# EAGLE board main board roller (EAGLE 9.5.1), part 1 of 2
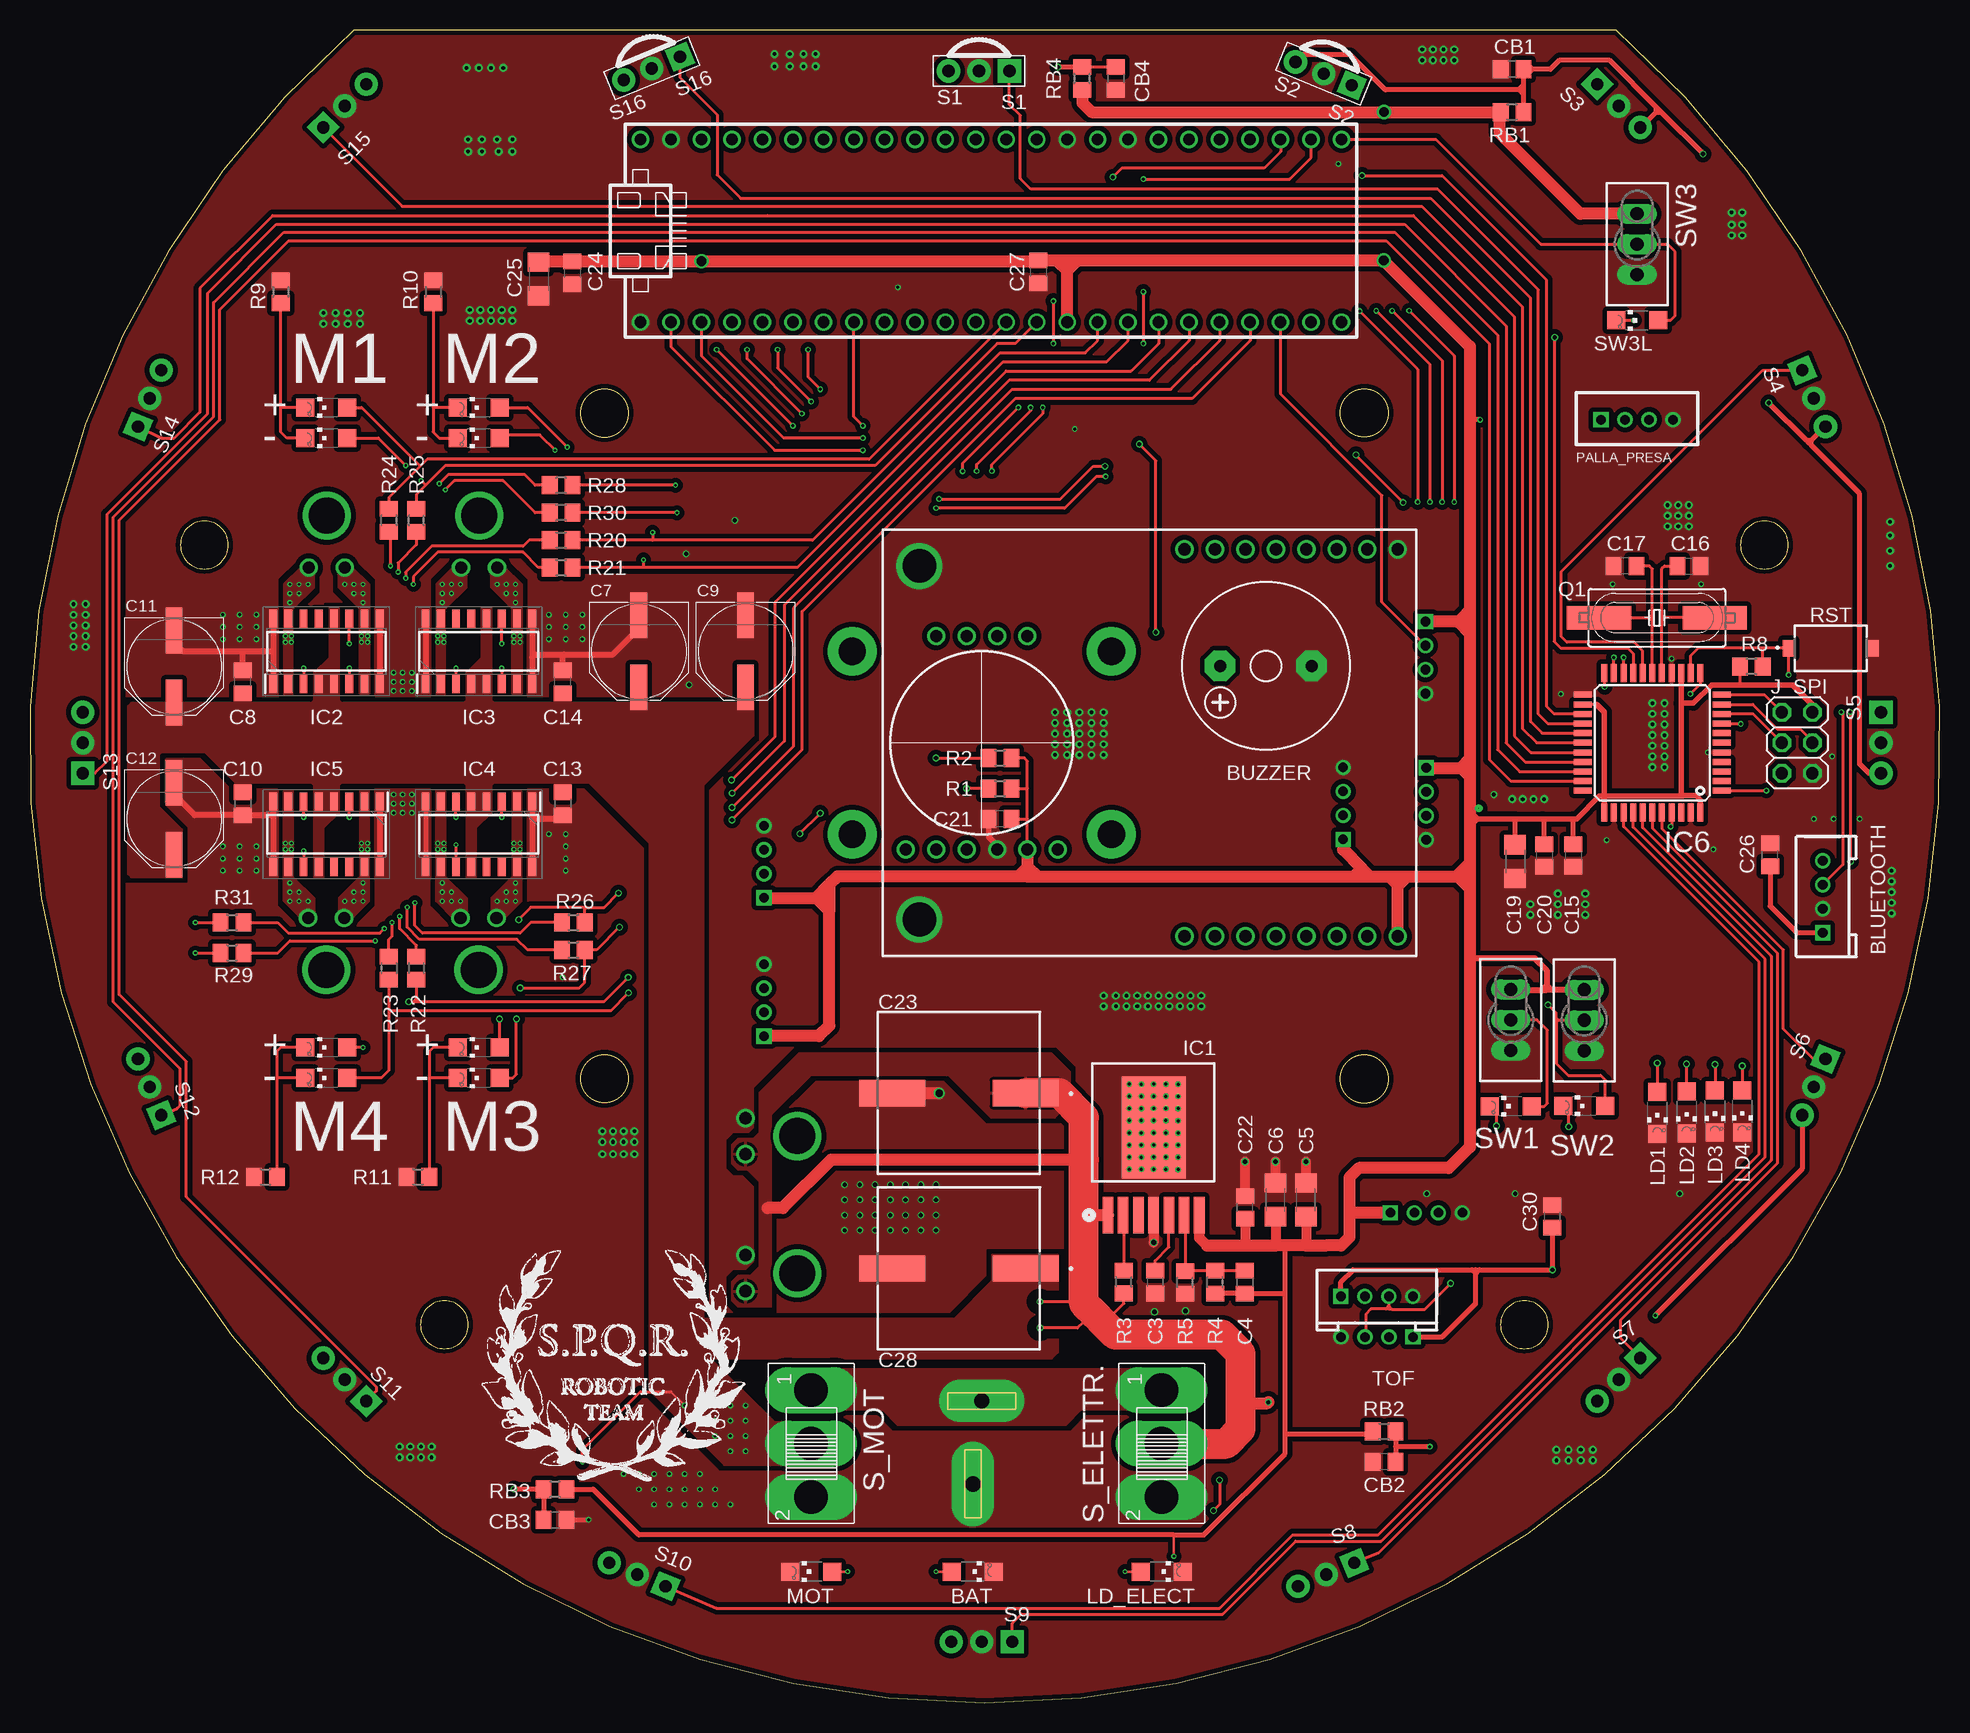
[diagram p1: board, top side]
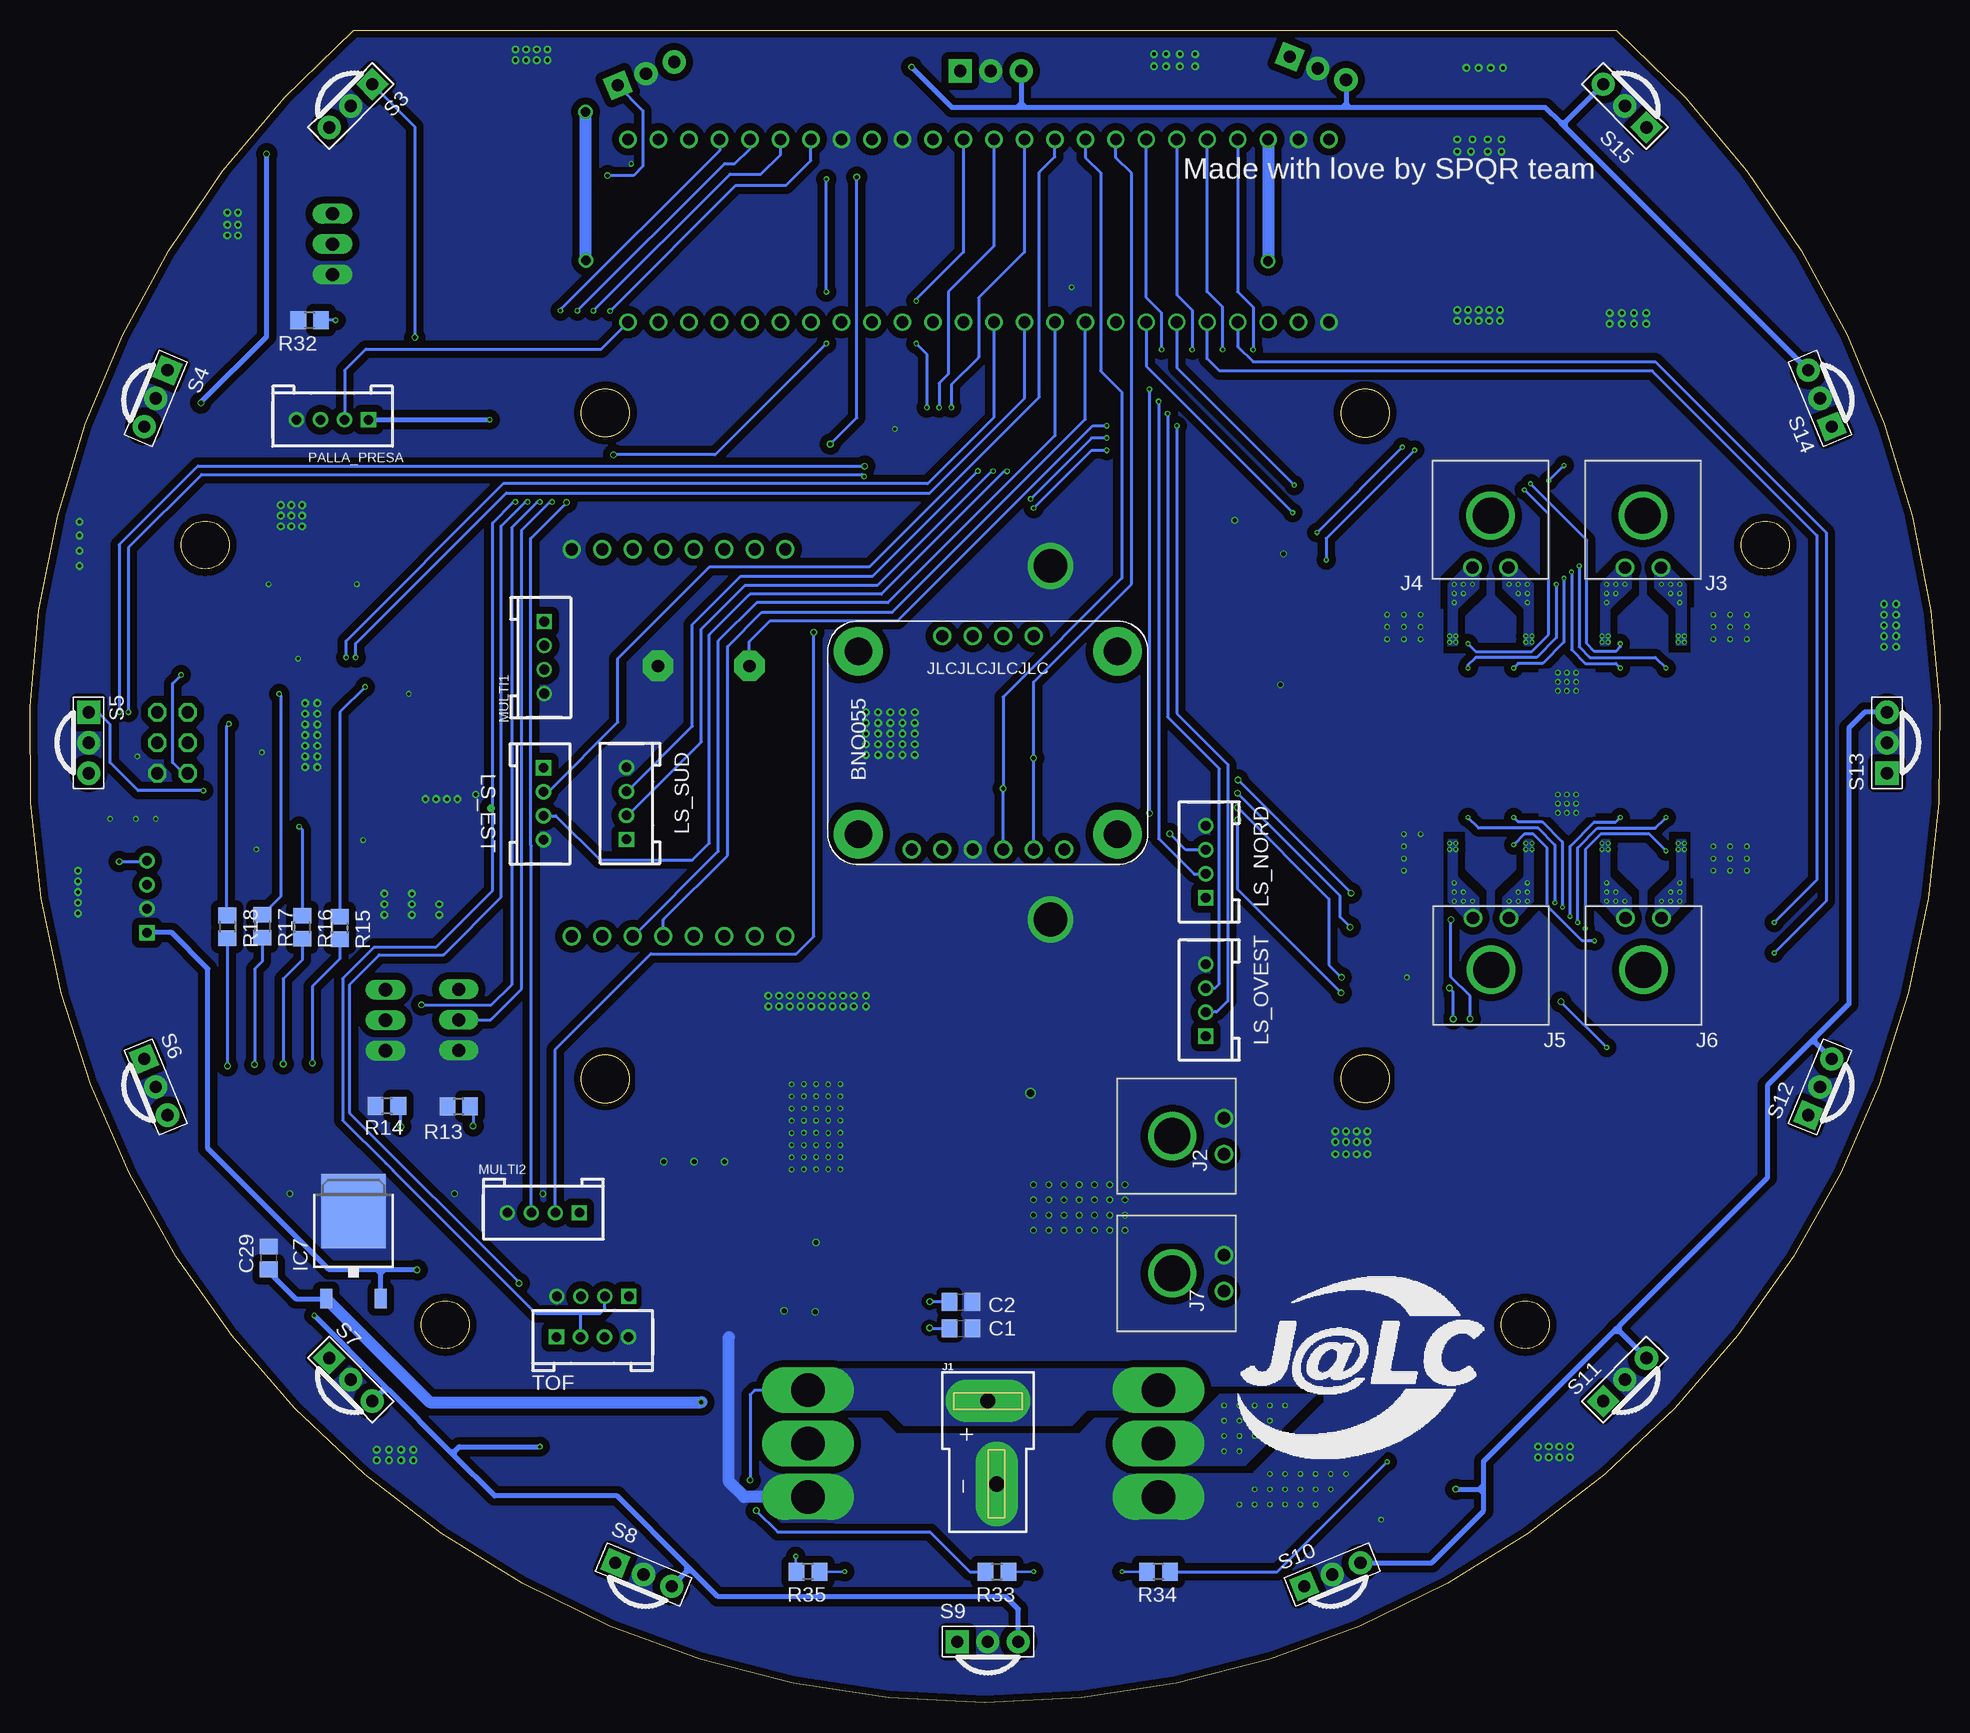
[diagram p2: board, bottom side, seen from below]

Size 159.14 x 139.44 mm. Coordinates in mm from the lower left corner, seen from the top.
Outline: 26.97,139.44 arc277 132.17,139.44 26.97,139.44
Outline: 124.54,29.52 arc180 124.54,33.52 arc180 124.54,29.52
Outline: 34.54,29.52 arc180 34.54,33.52 arc180 34.54,29.52
Outline: 14.54,94.52 arc180 14.54,98.52 arc180 14.54,94.52
Outline: 144.54,94.52 arc180 144.54,98.52 arc180 144.54,94.52
Outline: circle at 111.19,107.52 radius 2
Outline: circle at 111.19,52.02 radius 2
Outline: circle at 47.87,52.03 radius 2
Outline: circle at 47.87,107.52 radius 2
Copper layers (1*16): Top 0.035mm / dielectric 0.2mm / Bottom 0.035mm
Design rules "JLCPCB - 2 layers *": minimum track width 3.5mil, minimum drill 0.2mm, track to track 8mil, track to pad 8mil, pad to pad 8mil, via to via 8mil, smd to smd 0mil, copper to edge 0.1mm, drill to drill 5mil, minimum pad ring 4mil, minimum via ring 4mil, stop-mask expansion 3mil, vias tented up to drill 100mil, thermal gap 10mil
Net classes: 0 default: width 0.254 mm, drill 0.203 mm, clearance 0.203 mm; 1 Power: width 0.305 mm, clearance 0.305 mm to class 0, clearance 0.305 mm; 2 +5V/1: width 0.61 mm, drill 0.406 mm, clearance 0.254 mm to class 0, clearance 0.254 mm to class 1, clearance 0.254 mm

## Footprints (pad centres in the part's own frame; a part is rotated, then mirrored left to right if it is on the bottom)
2.0_1X4 = drill 0.8 pad 1.27 square: 1 -3,0 | drill 0.8 pad 1.27: 2 -1,0; 3 1,0; 4 3,0
CHIPLED_1206 = smd 1.5 x 1.5: A 0,-1.75; C 0,1.75
F/CM12P = drill 1.016 pad 2.54 octagon: + 3.81,0; - -3.81,0
C0805 = smd 1.3 x 1.5: 1 -0.95,0; 2 0.95,0
C1206 = smd 1.6 x 1.8: 1 -1.4,0; 2 1.4,0
PANASONIC_E = smd 3.8 x 1.4: + 3,0; - -3,0
FKV(H13) = smd 5.5 x 2.2: 1 -5.55,0; 2 5.55,0
NDW0007A = smd 0.89 x 3.06: 1 -3.81,0; 2 -2.54,0; 3 -1.27,0; 4 0,0; 5 1.27,0; 6 2.54,0; 7 3.81,0 | smd 5.35 x 8.54: 8 0,7.305
SOIC127P600X175-16N = smd 1.525 x 0.65: 1 -2.712,4.445; 2 -2.712,3.175; 3 -2.712,1.905; 4 -2.712,0.635; 5 -2.712,-0.635; 6 -2.712,-1.905; 7 -2.712,-3.175; 8 -2.712,-4.445; 9 2.712,-4.445; 10 2.712,-3.175; 11 2.712,-1.905; 12 2.712,-0.635; 13 2.712,0.635; 14 2.712,1.905; 15 2.712,3.175; 16 2.712,4.445
TQFP44 = smd 1.5 x 0.5: 1 -5.8,4; 2 -5.8,3.2; 3 -5.8,2.4; 4 -5.8,1.6; 5 -5.8,0.8; 6 -5.8,0; 7 -5.8,-0.8; 8 -5.8,-1.6; 9 -5.8,-2.4; 10 -5.8,-3.2; 11 -5.8,-4; 23 5.8,-4; 24 5.8,-3.2; 25 5.8,-2.4; 26 5.8,-1.6; 27 5.8,-0.8; 28 5.8,0; 29 5.8,0.8; 30 5.8,1.6; 31 5.8,2.4; 32 5.8,3.2; 33 5.8,4 | smd 0.5 x 1.5: 12 -4,-5.8; 13 -3.2,-5.8; 14 -2.4,-5.8; 15 -1.6,-5.8; 16 -0.8,-5.8; 17 0,-5.8; 18 0.8,-5.8; 19 1.6,-5.8; 20 2.4,-5.8; 21 3.2,-5.8; 22 4,-5.8; 34 4,5.8; 35 3.2,5.8; 36 2.4,5.8; 37 1.6,5.8; 38 0.8,5.8; 39 0,5.8; 40 -0.8,5.8; 41 -1.6,5.8; 42 -2.4,5.8; 43 -3.2,5.8; 44 -4,5.8
TO252 = smd 1 x 1.6: 1 -2.28,-4.8; 2 2.28,-4.8 | smd 5.4 x 6.2: 3 0,2.5
DEANS = drill 1.27 pad 3.556 long: + 0,0; - 0.737,-6.921
43650-0200 = drill 1.02 pad 1.52: 1 0,0; 2 -3,0 | drill 3 pad 3: 3 -1.5,-4.32
2X03 = drill 1.016 octagon: 1 -2.54,-1.27; 2 -2.54,1.27; 3 0,-1.27; 4 0,1.27; 5 2.54,-1.27; 6 2.54,1.27
HC49UP = smd 5.334 x 1.93: 1 -4.826,0; 2 4.826,0
R0805 = smd 1.3 x 1.5: 1 -0.95,0; 2 0.95,0
KSR = smd 1 x 1.4: 1 -3.5,0; 2 3.5,0
PNA460XM = drill 1.016 pad 1.93 square: 1 -2.54,0 | drill 1.016 pad 1.93: 2 0,0; 3 2.54,0
255SB = drill 2.8 pad 3.048 long: 1 2.667,3.556; 2 7.112,3.556; 3 11.557,3.556
TL3XPO = drill 1.1 pad 1.422 long: 1 -2.54,0; 2 0,0; 3 2.54,0
TEENSY_3.5/3.6 = drill 0.965: 0/RX -25.4,-7.62; 1/TX -22.86,-7.62; 2 -20.32,-7.62; 3/CANTX -17.78,-7.62; 3V3 7.62,-7.62; 3V3_LO -22.86,7.62; 4/CANRX -15.24,-7.62; 5 -12.7,-7.62; 6 -10.16,-7.62; 7 -7.62,-7.62; 8 -5.08,-7.62; 9/CS -2.54,-7.62; 10/CS 0,-7.62; 11/MOSI 2.54,-7.62; 12/MISO 5.08,-7.62; 13/SCK 5.08,7.62; 14/A0 2.54,7.62; 15/A1 0,7.62; 16/A2 -2.54,7.62; 17/A3 -5.08,7.62; 18/A4/SDA -7.62,7.62; 19/A5/SCL -10.16,7.62; 20/A6 -12.7,7.62; 21/A7 -15.24,7.62; 21/DAC0 12.7,7.62; 22/A8 -17.78,7.62; 23/A9 -20.32,7.62; 24 10.16,-7.62; 25 12.7,-7.62; 26 15.24,-7.62; 27 17.78,-7.62; 28 20.32,-7.62; 29 22.86,-7.62; 30 25.4,-7.62; 31/A12 27.94,-7.62; 32/A13 30.48,-7.62; 33/A14 30.48,7.62; 34/A15 27.94,7.62; 35/A16 25.4,7.62; 36/A17 22.86,7.62; 37/A18 20.32,7.62; 38/A19 17.78,7.62; 39/A20 15.24,7.62; A22/DAC1 10.16,7.62; AGND -25.4,7.62; GND -27.94,-7.62; GND2 7.62,7.62; VIN -27.94,7.62
OPENMV_H7 = drill 1.016: 3V3 1.651,1.524; BOOT 33.909,16.764; GND 33.909,1.524; P0 1.651,19.304; P1 1.651,16.764; P2 1.651,14.224; P3 1.651,11.684; P4 1.651,9.144; P5 1.651,6.604; P6 1.651,4.064; P7 33.909,6.604; P8 33.909,9.144; P9 33.909,11.684; RST 33.909,19.304; SYNC 33.909,14.224; VIN 33.909,4.064 | drill 2.794 pad 3.81: PAD1 3.048,41.402 | drill 2.794: PAD2 32.512,41.402
BNO055 = drill 1: 3V3 9.525,1.27; ADR 17.145,19.05; GND 12.065,1.27; INT 14.605,19.05; PS0 9.525,19.05; PS1 12.065,19.05; RST 19.685,1.27; SCL 17.145,1.27; SDA 14.605,1.27; VIN 6.985,1.27 | drill 2.286 pad 4.064: PAD@1 2.54,17.78; PAD@2 24.13,17.78; PAD@3 2.54,2.54; PAD@4 24.13,2.54

## Placement (x,y rotation side)
BALL  TWIG_2.0  [2.0_1X4]  133.92,106.95 180 bottom
BAT  [CHIPLED_1206]  78.55,10.94 270 top
BLUETOOTH  TWIG_2.0  [2.0_1X4]  149.39,67.2 90 top
BUZZER  F/CM12P  [F/CM12P]  102.99,86.43 180 top
C1  100n  [C0805]  81.55,31.22 0 bottom
C2  100n  [C0805]  81.57,33.43 0 bottom
C3  22n  [C0805]  93.75,35.08 270 top
C4  22n  [C0805]  101.23,35.06 270 top
C5  100u  [C1206]  106.33,41.93 90 top
C6  100u  [C1206]  103.79,41.93 90 top
C7  1OOu  [PANASONIC_E]  50.74,87.65 270 top
C8  1u  [C0805]  17.72,85.11 90 top
C9  100u  [PANASONIC_E]  59.63,87.65 270 top
C10  1u  [C0805]  17.72,74.95 270 top
C11  100u  [PANASONIC_E]  12,86.38 270 top
C12  100u  [PANASONIC_E]  12,73.68 270 top
C13  1u  [C0805]  44.39,74.95 270 top
C14  1u  [C0805]  44.39,85.11 90 top
C15  1u  [C0805]  128.59,70.63 270 top
C16  22pF  [C0805]  138.24,94.76 0 top
C17  22pF  [C0805]  132.91,94.76 180 top
C19  1u  [C1206]  123.76,70.12 270 top
C20  1u  [C0805]  126.18,70.63 270 top
C21  1u  [C0805]  80.84,73.68 180 top
C22  100n  [C0805]  101.25,41.29 90 top
C23  EEV-FK1C152Q  [FKV(H13)]  77.41,50.82 180 top
C24  100n  [C0805]  45.18,119.19 270 top
C25  100n  [C1206]  42.39,118.68 270 top
C26  1u  [C0805]  145,70.68 90 top
C27  100n  [C0805]  84.01,119.27 270 top
C28  EEV-FK1C152Q  [FKV(H13)]  77.41,36.21 180 top
C29  1uF  [C0805]  139.22,37.08 90 bottom
C30  1uF  [C0805]  126.87,40.54 90 top
CB1  0.1uF  [C0805]  123.51,136.16 180 top
CB2  0.1uF  [C0805]  112.84,20.08 180 top
CB3  0.1uF  [C0805]  43.75,15.26 0 top
CB4  0.1uF  [C0805]  90.49,135.4 270 top
IC1  LMZ14202TZE-ADJ_NOPB  [NDW0007A]  93.63,40.66 0 top
IC2  VNH7070ASTR  [SOIC127P600X175-16N]  24.7,87.65 90 top
IC3  VNH7070ASTR  [SOIC127P600X175-16N]  37.4,87.65 90 top
IC4  VNH7070ASTR  [SOIC127P600X175-16N]  37.4,72.41 270 top
IC5  VNH7070ASTR  [SOIC127P600X175-16N]  24.7,72.41 270 top
IC6  ATMEGA32U4-AU  [TQFP44]  135.19,80.03 180 top
IC7  7805DT  [TO252]  132.17,38.49 0 bottom
J1  [DEANS]  79.31,25.16 0 bottom
J2  43650-0201  [43650-0200]  59.63,45.74 270 bottom
J3  43650-0201  [43650-0200]  26.23,94.63 180 bottom
J4  43650-0201  [43650-0200]  38.93,94.63 180 bottom
J5  43650-0201  [43650-0200]  35.88,65.42 0 bottom
J6  43650-0201  [43650-0200]  23.18,65.42 0 bottom
J7  43650-0201  [43650-0200]  59.63,34.31 270 bottom
J_SPI  [2X03]  147.26,80.03 270 top
LD1  [CHIPLED_1206]  135.61,49.16 180 top
LD2  [CHIPLED_1206]  138.05,49.23 180 top
LD3  [CHIPLED_1206]  140.41,49.28 180 top
LD4  [CHIPLED_1206]  142.69,49.31 180 top
LD_ELECT  [CHIPLED_1206]  94.3,10.94 270 top
LS_EST  TWIG_2.0  [2.0_1X4]  116.35,74.93 270 bottom
LS_NORD  TWIG_2.0  [2.0_1X4]  61.16,70.11 90 bottom
LS_OVEST  TWIG_2.0  [2.0_1X4]  61.16,58.57 90 bottom
LS_SUD  TWIG_2.0  [2.0_1X4]  109.43,74.97 90 bottom
M1+  [CHIPLED_1206]  24.7,107.97 90 top
M1-  [CHIPLED_1206]  24.7,105.43 90 top
M2+  [CHIPLED_1206]  37.4,107.97 90 top
M2-  [CHIPLED_1206]  37.4,105.43 90 top
M3+  [CHIPLED_1206]  37.4,54.63 90 top
M3-  [CHIPLED_1206]  37.4,52.09 90 top
M4+  [CHIPLED_1206]  24.7,54.63 90 top
M4-  [CHIPLED_1206]  24.7,52.09 90 top
MOT  [CHIPLED_1206]  65.09,10.94 90 top
MULTI1  TWIG_2.0  [2.0_1X4]  116.28,87.13 270 bottom
MULTI2  TWIG_2.0  [2.0_1X4]  116.36,40.85 180 bottom
Q1  [HC49UP]  135.58,90.44 180 top
R1  10k  [R0805]  80.84,76.22 0 top
R2  10k  [R0805]  80.84,78.76 0 top
R3  61,9k  [R0805]  91.15,35.08 90 top
R4  3,32k  [R0805]  98.75,35.06 90 top
R5  1,07k  [R0805]  96.25,35.04 90 top
R8  10k  [R0805]  143.45,86.38 180 top
R9  180R  [R0805]  20.89,117.62 270 top
R10  180R  [R0805]  33.59,117.62 270 top
R11  180R  [R0805]  32.32,43.83 0 top
R12  180R  [R0805]  19.62,43.83 0 top
R13  180R  [R0805]  123.41,49.7 180 bottom
R14  180R  [R0805]  129.4,49.75 180 bottom
R15  180R  [R0805]  133.32,64.59 270 bottom
R16  180R  [R0805]  136.46,64.66 270 bottom
R17  180R  [R0805]  139.77,64.73 270 bottom
R18  180R  [R0805]  142.68,64.68 270 bottom
R20  10k  [R0805]  44.26,96.92 0 top
R21  10k  [R0805]  44.26,94.63 0 top
R22  10k  [R0805]  32.2,61.23 270 top
R23  10k  [R0805]  29.91,61.23 270 top
R24  10k  [R0805]  29.91,98.57 90 top
R25  10k  [R0805]  32.2,98.57 90 top
R26  10k  [R0805]  45.28,65.04 0 top
R27  10k  [R0805]  45.28,62.76 0 top
R28  10k  [R0805]  44.26,101.49 180 top
R29  10k  [R0805]  16.83,62.5 0 top
R30  10k  [R0805]  44.26,99.2 180 top
R31  10k  [R0805]  16.83,65.04 0 top
R32  180R  [R0805]  135.83,115.24 180 bottom
R33  1.2k  [R0805]  78.55,10.94 0 bottom
R34  1.2k  [R0805]  65.09,10.94 180 bottom
R35  180R  [R0805]  94.3,10.94 180 bottom
RB1  22  [R0805]  123.51,132.61 0 top
RB2  22  [R0805]  112.84,22.62 0 top
RB3  22  [R0805]  43.75,17.8 180 top
RB4  22  [R0805]  87.7,135.4 90 top
RST  KSR231GLFS  [KSR]  150.05,87.9 0 top
S1  PNA460XM  [PNA460XM]  79.08,136.03 180 top
S2  PNA460XM  [PNA460XM]  107.81,135.8 157.5 top
S3  PNA460XM  [PNA460XM]  132.4,133.11 225 bottom
S4  PNA460XM  [PNA460XM]  148.66,108.73 247.5 bottom
S5  PNA460XM  [PNA460XM]  154.24,80.03 270 bottom
S6  PNA460XM  [PNA460XM]  148.66,51.33 292.5 bottom
S7  PNA460XM  [PNA460XM]  132.4,26.94 315 bottom
S8  PNA460XM  [PNA460XM]  108.02,10.69 337.5 bottom
S9  PNA460XM  [PNA460XM]  79.31,5.1 0 bottom
S10  PNA460XM  [PNA460XM]  50.61,10.69 22.5 bottom
S11  PNA460XM  [PNA460XM]  26.23,26.94 45 bottom
S12  PNA460XM  [PNA460XM]  9.97,51.33 67.5 bottom
S13  PNA460XM  [PNA460XM]  4.38,80.03 90 bottom
S14  PNA460XM  [PNA460XM]  9.97,108.73 112.5 bottom
S15  PNA460XM  [PNA460XM]  26.23,133.11 135 bottom
S16  PNA460XM  [PNA460XM]  51.81,136.24 202.5 top
S_ELETTR.  [255SB]  90.74,28.72 270 top
S_MOT  [255SB]  61.53,28.72 270 top
SW1  TL38PO  [TL3XPO]  123.4,56.93 270 top
SW1L  [CHIPLED_1206]  123.38,49.73 90 top
SW2  TL38PO  [TL3XPO]  129.51,56.9 270 top
SW2L  [CHIPLED_1206]  129.52,49.77 90 top
SW3  TL38PO  [TL3XPO]  133.92,121.59 270 top
SW3L  [CHIPLED_1206]  133.92,115.24 90 top
TOF  TWIG_2.0  [2.0_1X4]  112.25,30.5 0 bottom
TOF_TOP  TWIG_2.0  [2.0_1X4]  112.23,33.88 0 top
U$1  TEENSY_3.5/3.6  [TEENSY_3.5/3.6]  78.81,122.71 0 top
U$2  OPENMV_H7  [OPENMV_H7]  115.51,62.25 90 top
U$4  BNO055  [BNO055]  92.65,69.87 0 bottom